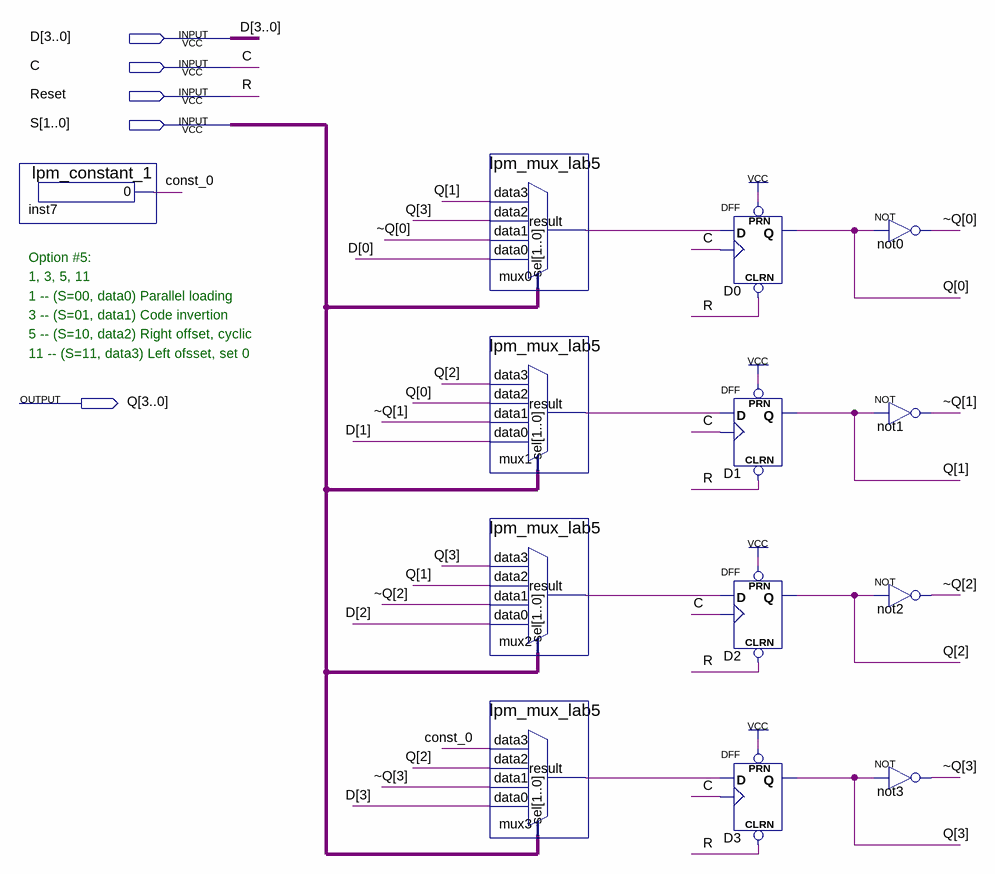
[diagram p0: schematic sheet]
// Quartus schematic Lab5_2.bdf as structural Verilog: 13 symbols, 5 pins
module Lab5_2 (
  input  [3:0] D,
  input  C,
  input  Reset,
  input  [1:0] S,
  output [3:0] Q
);

  wire const_0, mux0_result, mux1_result, mux2_result, mux3_result;
  wire [3:0] \~Q ;

  lpm_constant_1 inst7 (.result(const_0));
  lpm_mux_lab5 mux0 (.data3(Q[1]), .data2(Q[3]), .data1(\~Q [0]), .data0(D[0]), .sel(S), .result(mux0_result));
  lpm_mux_lab5 mux1 (.data3(Q[2]), .data2(Q[0]), .data1(\~Q [1]), .data0(D[1]), .sel(S), .result(mux1_result));
  lpm_mux_lab5 mux2 (.data3(Q[3]), .data2(Q[1]), .data1(\~Q [2]), .data0(D[2]), .sel(S), .result(mux2_result));
  lpm_mux_lab5 mux3 (.data3(const_0), .data2(Q[2]), .data1(\~Q [3]), .data0(D[3]), .sel(S), .result(mux3_result));
  DFF D0 (.CLRN(Reset), .CLK(C), .D(mux0_result), .PRN(1'b1), .Q(Q[0]));
  DFF D1 (.CLRN(Reset), .CLK(C), .D(mux1_result), .PRN(1'b1), .Q(Q[1]));
  DFF D2 (.CLRN(Reset), .CLK(C), .D(mux2_result), .PRN(1'b1), .Q(Q[2]));
  DFF D3 (.CLRN(Reset), .CLK(C), .D(mux3_result), .PRN(1'b1), .Q(Q[3]));
  not not0 (\~Q [0], Q[0]);
  not not1 (\~Q [1], Q[1]);
  not not2 (\~Q [2], Q[2]);
  not not3 (\~Q [3], Q[3]);

  // Other names for the same wires on the sheet: R = Reset

  // Notes on the sheet:
  //   Option #5:
  //   1, 3, 5, 11
  //   1 -- (S=00, data0) Parallel loading
  //   3 -- (S=01, data1) Code invertion
  //   5 -- (S=10, data2) Right offset, cyclic
  //   11 -- (S=11, data3) Left ofsset, set 0
endmodule
